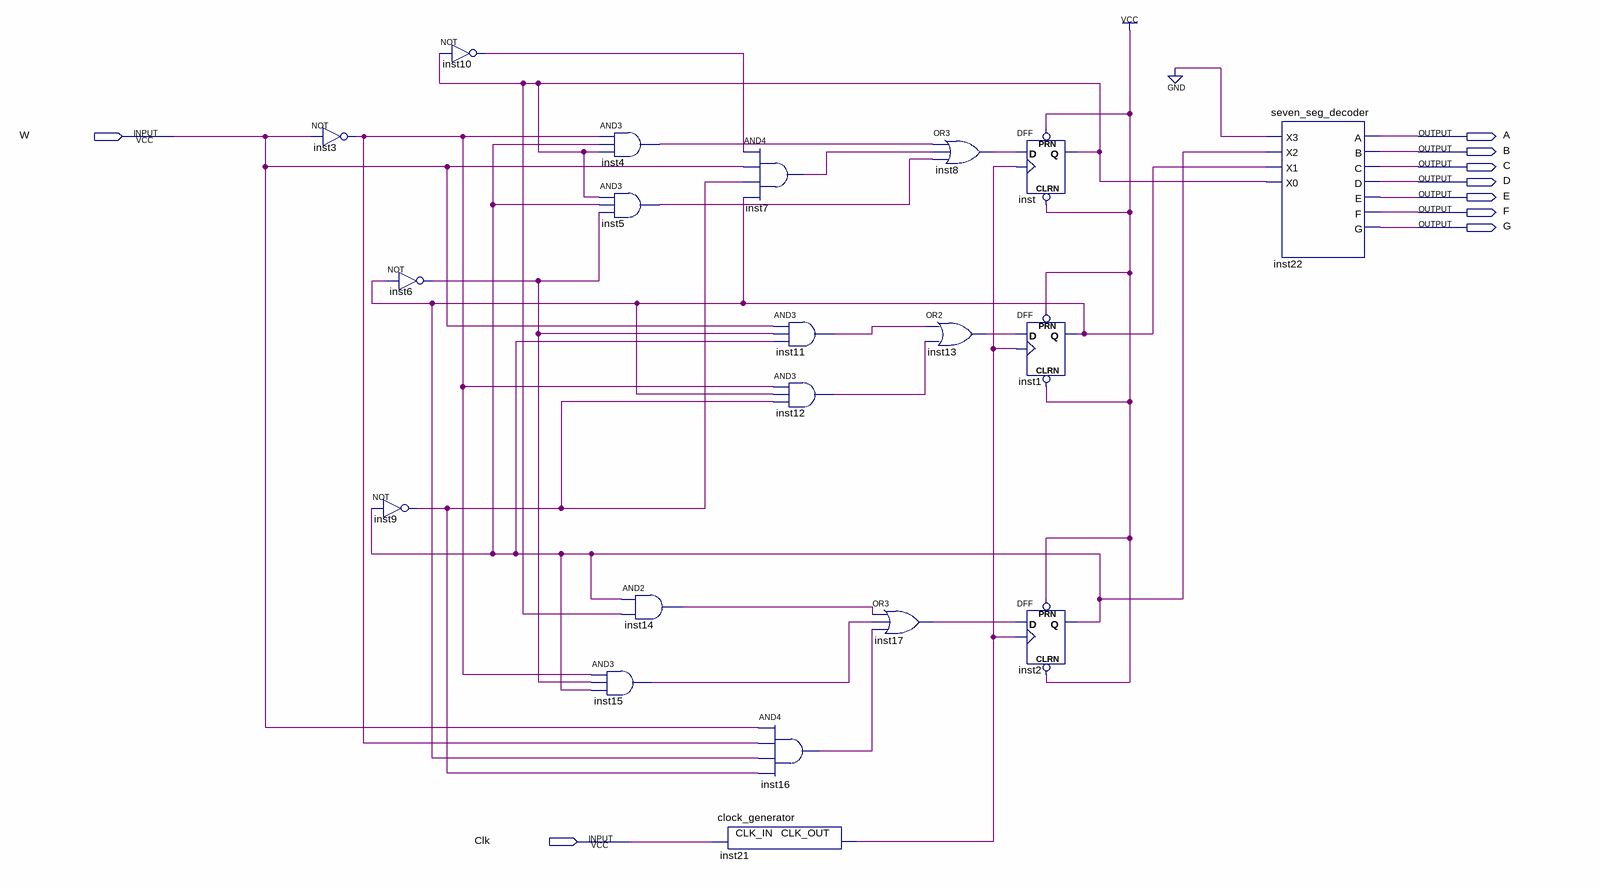
[diagram p0: schematic sheet]
// Quartus schematic lab11step3.bdf as structural Verilog: 20 symbols, 9 pins
module lab11step3 (
  input  W,
  input  Clk,
  output A,
  output B,
  output C,
  output D,
  output E,
  output F,
  output G
);

  wire inst1_q, inst2_q, inst3_out, inst4_out, inst5_out, inst6_out, inst7_out, inst8_out, inst9_out,
       inst10_out, inst11_out, inst12_out, inst13_out, inst14_out, inst15_out, inst16_out, inst17_out,
       inst21_clk_out, inst_q;

  not inst3 (inst3_out, W);
  not inst6 (inst6_out, inst1_q);
  not inst9 (inst9_out, inst2_q);
  not inst10 (inst10_out, inst_q);
  and inst4 (inst4_out, inst3_out, inst2_q, inst_q);
  and inst5 (inst5_out, inst_q, inst2_q, inst6_out);
  and inst15 (inst15_out, inst3_out, inst6_out, inst2_q);
  and inst14 (inst14_out, inst2_q, inst_q);
  clock_generator inst21 (.CLK_IN(Clk), .CLK_OUT(inst21_clk_out));
  and inst7 (inst7_out, inst10_out, W, inst9_out, inst1_q);
  and inst11 (inst11_out, W, inst6_out, inst2_q);
  and inst12 (inst12_out, inst3_out, inst1_q, inst9_out);
  and inst16 (inst16_out, W, inst3_out, inst1_q, inst9_out);
  or inst17 (inst17_out, inst14_out, inst15_out, inst16_out);
  or inst8 (inst8_out, inst4_out, inst7_out, inst5_out);
  or inst13 (inst13_out, inst11_out, inst12_out);
  DFF inst (.CLRN(1'b1), .CLK(inst21_clk_out), .D(inst8_out), .PRN(1'b1), .Q(inst_q));
  DFF inst1 (.CLRN(1'b1), .CLK(inst21_clk_out), .D(inst13_out), .PRN(1'b1), .Q(inst1_q));
  DFF inst2 (.CLRN(1'b1), .CLK(inst21_clk_out), .D(inst17_out), .PRN(1'b1), .Q(inst2_q));
  seven_seg_decoder inst22 (
    .X3(1'b0), .X2(inst2_q), .X1(inst1_q), .X0(inst_q), .A(A), .B(B), .C(C), .D(D), .E(E), .F(F), .G(G));
endmodule
